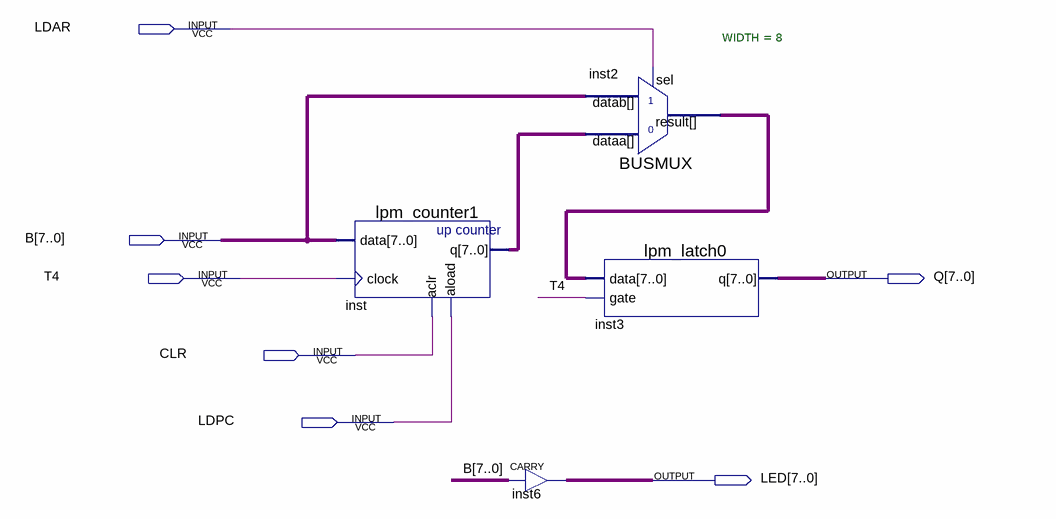
[diagram p0: schematic sheet]
// Quartus schematic PCAR.bdf as structural Verilog: 4 symbols, 7 pins
module PCAR (
  input  LDAR,
  input  [7:0] B,
  input  T4,
  input  CLR,
  input  LDPC,
  output [7:0] Q,
  output [7:0] LED
);

  wire [7:0] inst2_result, inst_q;

  lpm_counter1 inst (.data(B), .clock(T4), .aclr(CLR), .aload(LDPC), .q(inst_q));
  CARRY inst6[7:0] (.IN(B), .OUT(LED));
  BUSMUX #(.WIDTH(8)) inst2 (.datab(B), .sel(LDAR), .dataa(inst_q), .result(inst2_result));
  lpm_latch0 inst3 (.data(inst2_result), .gate(T4), .q(Q));
endmodule
